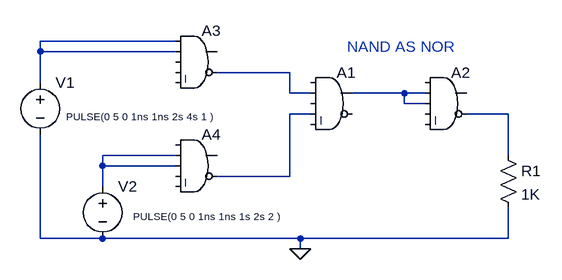
[diagram p0: schematic Draft7.asc]
Draft7.asc, the LTspice schematic file:
Version 4
SHEET 1 880 680
WIRE -48 0 -256 0
WIRE -256 16 -256 0
WIRE -48 16 -256 16
WIRE 128 48 16 48
WIRE -256 64 -256 16
WIRE 128 80 128 48
WIRE 160 80 128 80
WIRE 304 80 224 80
WIRE 336 80 304 80
WIRE 304 96 304 80
WIRE 336 96 304 96
WIRE 160 112 128 112
WIRE 464 112 400 112
WIRE -48 176 -160 176
WIRE 464 176 464 112
WIRE -160 192 -160 176
WIRE -48 192 -160 192
WIRE 128 208 128 112
WIRE 128 208 16 208
WIRE -160 224 -160 192
WIRE -256 304 -256 144
WIRE -160 304 -256 304
WIRE 144 304 -160 304
WIRE 464 304 464 256
WIRE 464 304 144 304
WIRE 144 320 144 304
FLAG 144 320 0
SYMBOL Digital\\and 192 32 R0
SYMATTR InstName A1
SYMBOL Digital\\and 368 32 R0
SYMATTR InstName A2
SYMBOL Digital\\and -16 -32 R0
SYMATTR InstName A3
SYMBOL Digital\\and -16 128 R0
SYMATTR InstName A4
SYMBOL voltage -256 48 R0
WINDOW 3 40 68 Left 1
SYMATTR InstName V1
SYMATTR Value PULSE(0 5 0 1ns 1ns 2s 4s 1 )
SYMBOL voltage -160 208 R0
WINDOW 3 47 62 Left 1
SYMATTR InstName V2
SYMATTR Value PULSE(0 5 0 1ns 1ns 1s 2s 2 )
SYMBOL res 448 160 R0
SYMATTR InstName R1
SYMATTR Value 1K
TEXT 216 8 Left 2 ;NAND AS NOR

The netlist it stands for:
* Draft7.asc
A1 0 N002 0 N004 0 0 N003 0 AND
A2 0 N003 N003 0 0 N005 0 0 AND
A3 N001 N001 0 0 0 N002 0 0 AND
A4 0 N006 N006 0 0 N004 0 0 AND
V1 N001 0 PULSE(0 5 0 1ns 1ns 2s 4s 1 )
V2 N006 0 PULSE(0 5 0 1ns 1ns 1s 2s 2 )
R1 N005 0 1K
* NAND AS NOR
.backanno
.end